# Altium schematic sheet HAE_MCU.SchDoc
size A; SheetNumber: 3; SheetTotal: 6
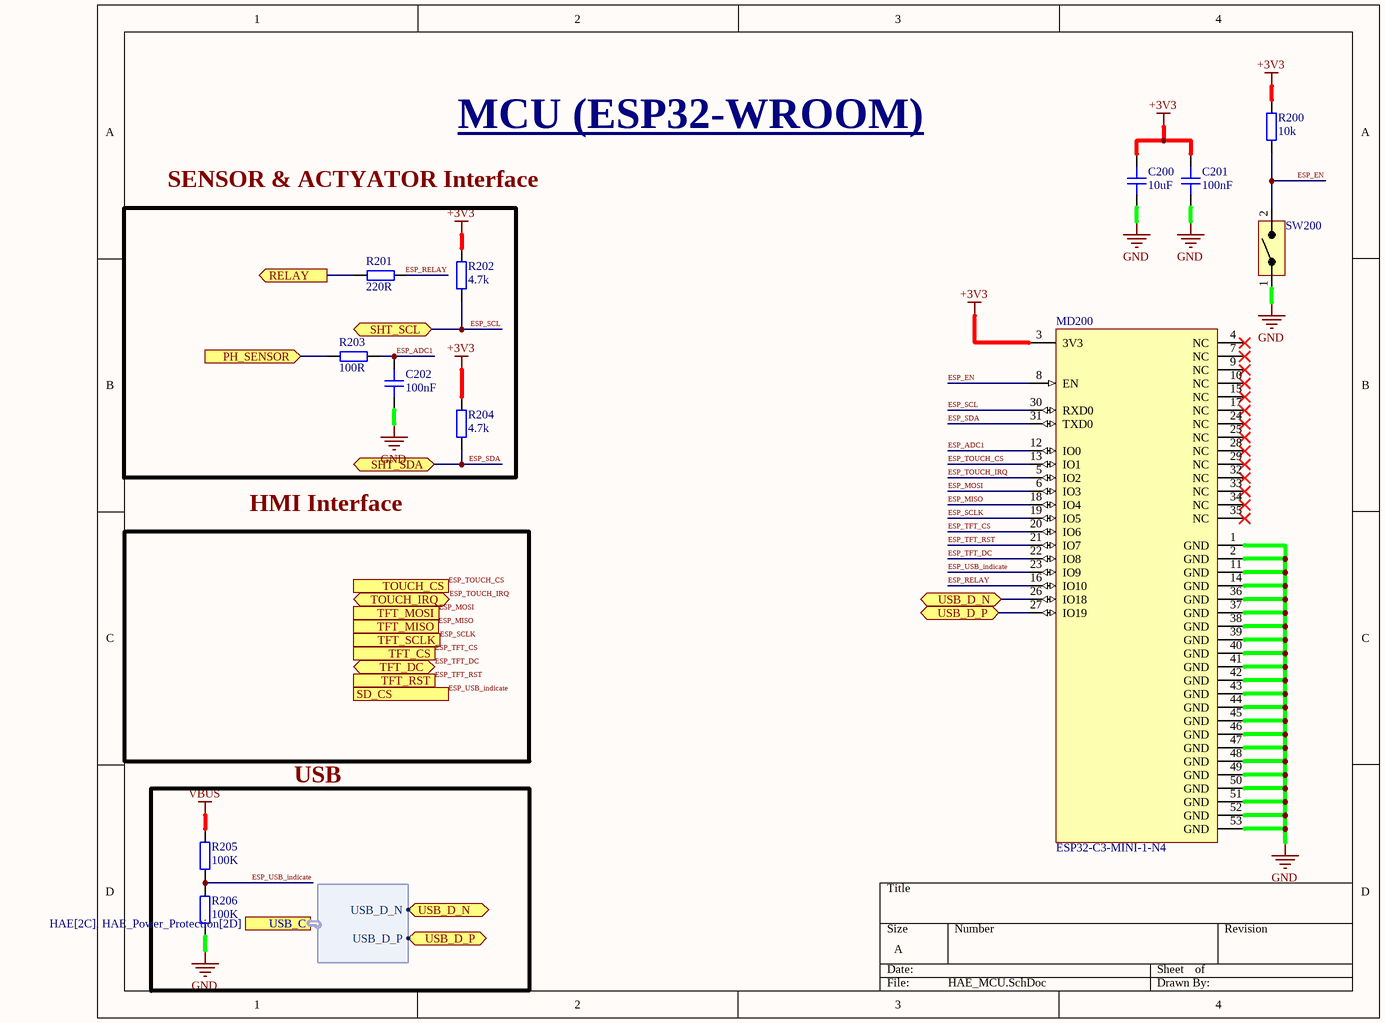
[diagram p0: HAE_MCU.SchDoc]

## Parts
C200  10uF  [CAP_0402]
C201  100nF  [CAP_0603]
C202  100nF  [CAP_0603]
MD200  ESP32-C3-MINI-1-N4  [FP-ESP32-C3-MINI-1-N4-MFG]
R200  10k  [RES_0402]
R201  220R  [RES_0402]
R202  4.7k  [RES_0402]
R203  100R  [RES_0402]
R204  4.7k  [RES_0402]
R205  100K  [RES_0402]
R206  100K  [RES_0402]
SW200  B3U-1000P  [B3U_1000P]  (value not drawn)

## Blocks framed on the sheet
SENSOR & ACTYATOR Interface: C202 R201-R204
USB: R205 R206

## Ports
PH_SENSOR (in), RELAY (out), SD_CS (out), SHT_SCL (bidir), SHT_SDA (bidir), TFT_CS (out), TFT_DC (bidir), TFT_MISO (in), TFT_MOSI (out), TFT_RST (out), TFT_SCLK (out), TOUCH_CS (out), TOUCH_IRQ (bidir), USB_C (harness USB_C, see HAE[2C], HAE_Power_Protection[2D]), USB_D_N (bidir), USB_D_P (bidir)

## Harnesses
USB_C: USB_D_N, USB_D_P

## Nets
+3V3: C200.2 C201.2 MD200.3(3V3) R200.2 R202.2 R204.2
GND: C200.1 C201.1 C202.1 MD200.1(GND) MD200.2(GND) MD200.11(GND) MD200.14(GND) MD200.36(GND) MD200.37(GND) MD200.38(GND) MD200.39(GND) MD200.40(GND) MD200.41(GND) MD200.42(GND) MD200.43(GND) MD200.44(GND) MD200.45(GND) MD200.46(GND) MD200.47(GND) MD200.48(GND) MD200.49(GND) MD200.50(GND) MD200.51(GND) MD200.52(GND) MD200.53(GND) R206.2 SW200.1
VBUS: R205.1
ESP_ADC1: C202.2 MD200.12(IO0) R203.1
ESP_EN: MD200.8(EN) R200.1 SW200.2
ESP_MISO: MD200.18(IO4) ; port TFT_MISO
ESP_MOSI: MD200.6(IO3) ; port TFT_MOSI
ESP_RELAY: MD200.16(IO10) R201.1
ESP_SCL: MD200.30(RXD0) R202.1 ; port SHT_SCL
ESP_SCLK: MD200.19(IO5) ; port TFT_SCLK
ESP_SDA: MD200.31(TXD0) R204.1 ; port SHT_SDA
ESP_TFT_CS: MD200.20(IO6) ; port TFT_CS
ESP_TFT_DC: MD200.22(IO8) ; port TFT_DC
ESP_TFT_RST: MD200.21(IO7) ; port TFT_RST
ESP_TOUCH_CS: MD200.13(IO1) ; port TOUCH_CS
ESP_TOUCH_IRQ: MD200.5(IO2) ; port TOUCH_IRQ
ESP_USB_indicate: MD200.23(IO9) R205.2 R206.1 ; port SD_CS
PH_SENSOR: R203.2 ; port PH_SENSOR
RELAY: R201.2 ; port RELAY
USB_D_N: MD200.26(IO18) ; port USB_D_N, port USB_C.USB_D_N
USB_D_P: MD200.27(IO19) ; port USB_D_P, port USB_C.USB_D_P

Not connected (* = marked no-connect by the designer): MD200 4(NC)* 7(NC)* 9(NC)* 10(NC)* 15(NC)* 17(NC)* 24(NC)* 25(NC)* 28(NC)* 29(NC)* 32(NC)* 33(NC)* 34(NC)* 35(NC)*

## Notes on the sheet
- MCU (ESP32-WROOM)
- HMI Interface

## Library data of the parts
C200 = CAP_0402: Capacitor SMD 0402; Manufacturer: *; Manufacturer Part Number: *; Distributor Link: *; LCSC: *; Rating: *; Dielectric: *
C201 C202 = CAP_0603: Capacitor SMD 0603; Manufacturer: *; Manufacturer Part Number: *; Distributor Link: *; LCSC: *; Rating: *; Dielectric: *
MD200 = CMP-10700-116589975-1: Multiprotocol Modules SMD module, ESP32-C3FN4, PCB antenna, -40 C +85 C; Max Frequency: 2.484GHz; Min Supply Voltage: 3V; Current - Transmitting: 350mA; Interface: SPI; Data Rate: 150Mbps; Max Supply Voltage: 3.6V; Number of GPIO: 13; Current - Receiving: 84mA; Min Operating Temperature: -40°C; Height: 2.55mm; Ambient Temperature Range High: 85°C; Max Operating Temperature: 85°C
R200-R206 = RES_0402: Resistor SMD 0402; Manufacturer: *; Manufacturer Part Number: *; Distributor Link: *; LCSC: *
SW200 = B3U-1000P: Tactile Switch SPST-NO Top Actuated Surface Mount; Manufacturer: Omron; Mechanical Life: 200000Cycles; Contact Current Rating: 50mA; Operating Force: 1.5N; Throw Configuration: SPST; Voltage Rating (DC): 12V; Contact Resistance: 100mR; Illumination Type: Non-Illuminated,Illuminated; Switch Travel: 0.15mm; Switch Function: Off-Mom; Actuator Length: 0.4mm; IP Rating: IP40,Dust Proof; Supplier 1: Digi-Key; Manufacturer Part Number: B3U-1000P; Stock 1: 104895; Pricing 1: 1=1, 10=0.961, 25=0.9064, 50=0.7976, 100=0.7251, 250=0.6889, 500=0.6707, 1000=0.5257 (USD); Mount: Surface Mount; Weight: 0.000776oz; Contact Material: Silver; Min Operating Temperature: -25°C; Max Operating Temperature: 70°C; Max Current Rating: 50mA; Packaging: Tape and Reel; Package Quantity: 1; Max Voltage Rating (DC): 12V; Current Rating: 50mA; Termination: SMD/SMT; Electrical Life: 200000Cycles; Insulation Resistance: 100MR; Orientation: Straight; Length: 4mm; Height: 1.2mm; Width: 3mm; Depth: 2.5mm; REACH SVHC: Unknown; Lead Free: Lead Free; ComponentLink1URL: https://datasheet.ciiva.com/26917/getdatasheetpartid-552554-26917552.pdf; ComponentLink1Description: https://datasheet.ciiva.com/26917/getdatasheetpartid-552554-26917552.pdf; ComponentLink2URL: https://datasheet.ciiva.com/22696/1685550-22696214.pdf; ComponentLink2Description: https://datasheet.ciiva.com/22696/1685550-22696214.pdf; ComponentLink3URL: https://datasheet.ciiva.com/1532/1685550-1532680.pdf; ComponentLink3Description: https://datasheet.ciiva.com/1532/1685550-1532680.pdf; ComponentLink4URL: https://datasheet.ciiva.com/1634/1685550-1634396.pdf; ComponentLink4Description: https://datasheet.ciiva.com/1634/1685550-1634396.pdf; ComponentLink5URL: https://datasheet.ciiva.com/14142/b3u-eng-datasheet-14142540.pdf; ComponentLink5Description: https://datasheet.ciiva.com/14142/b3u-eng-datasheet-14142540.pdf; ComponentLink6URL: https://datasheet.ciiva.com/2900/b3u-1110-2900029.pdf; ComponentLink6Description: https://datasheet.ciiva.com/2900/b3u-1110-2900029.pdf; ComponentLink7URL: https://datasheet.ciiva.com/16155/en-b3u-16155021.pdf; ComponentLink7Description: https://datasheet.ciiva.com/16155/en-b3u-16155021.pdf; ComponentLink8URL: https://datasheet.ciiva.com/2900/b3u-1110-2900030.pdf; ComponentLink8Description: https://datasheet.ciiva.com/2900/b3u-1110-2900030.pdf; ComponentLink9URL: https://datasheet.ciiva.com/16862/70176037-16862846.pdf; ComponentLink9Description: https://datasheet.ciiva.com/16862/70176037-16862846.pdf; ComponentLink10URL: https://datasheet.ciiva.com/2900/b3u-1110-2900031.pdf; ComponentLink10Description: https://datasheet.ciiva.com/2900/b3u-1110-2900031.pdf; Supplier Part Number 1: SW1020DKR-ND